# EAGLE schematic PCB Class (EAGLE 8.7.1)
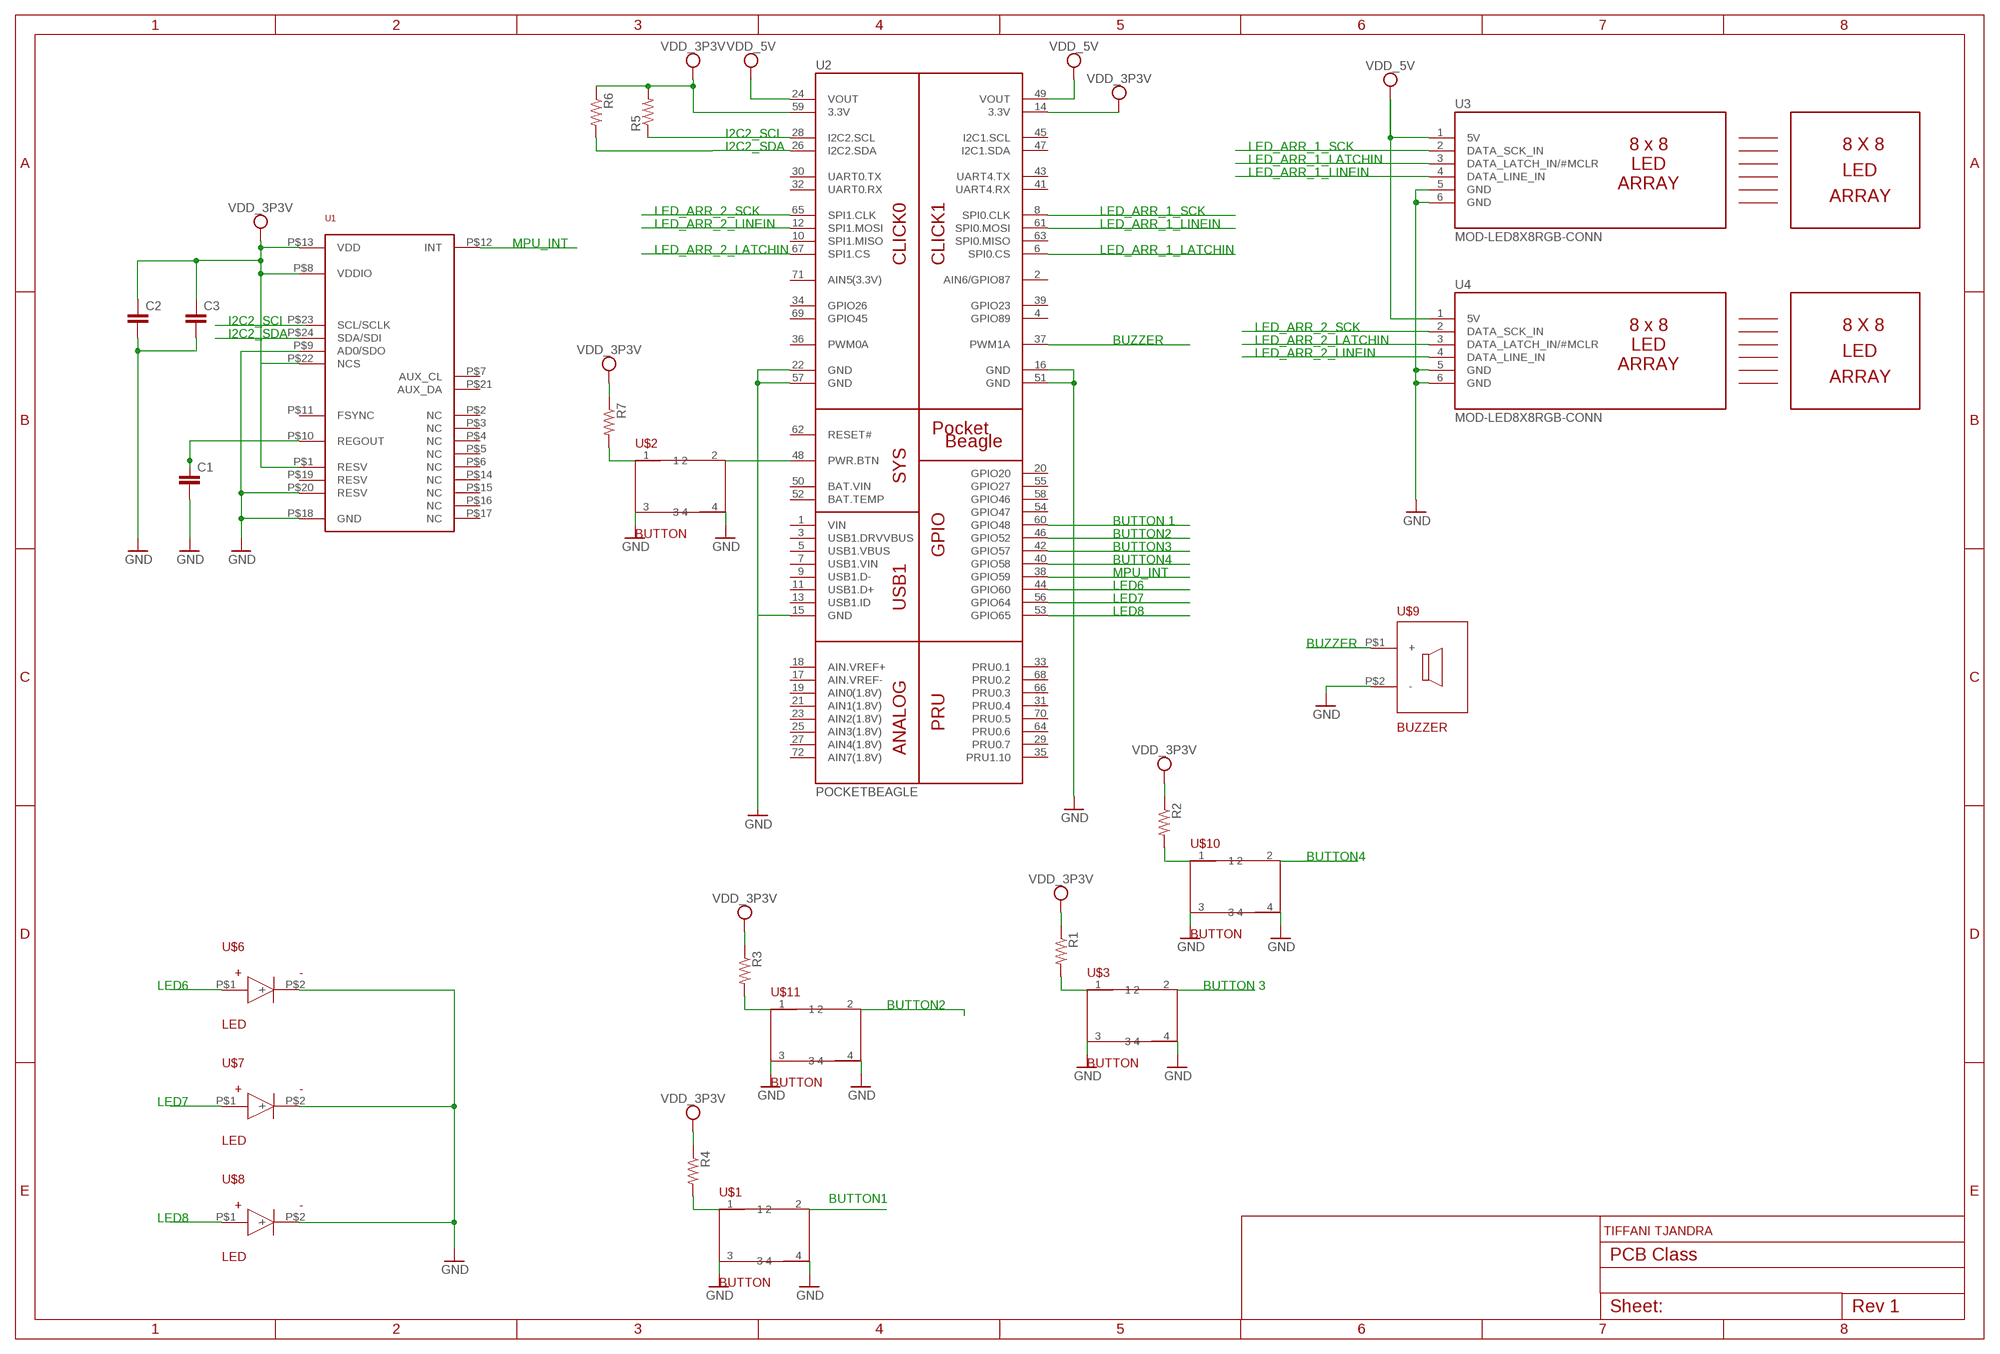
[diagram p0: schematic, sheet 1]

## Parts
C1  C_C0402  [C0402]
C2  C_C0402  [C0402]
C3  C_C0402  [C0402]
R1  R_R6332W  [R6332W]
R2  R_R6332W  [R6332W]
R3  R_R6332W  [R6332W]
R4  R_R6332W  [R6332W]
R5  R_R0402  [R0402]
R6  R_R0402  [R0402]
R7  R_R6332W  [R6332W]
U1  MPU-9250  [PROJECT01]
U2  POCKETBEAGLE  [POCKETBEAGLE]
U3  MOD-LED8X8RGB-CONN  [FE06W]
U4  MOD-LED8X8RGB-CONN  [FE06W]
U$1  BUTTON  [BUTTON]
U$2  BUTTON  [BUTTON]
U$3  BUTTON  [BUTTON]
U$6  LED  [LED]
U$7  LED  [LED]
U$8  LED  [LED]
U$9  BUZZER  [BUZZER]
U$10  BUTTON  [BUTTON]
U$11  BUTTON  [BUTTON]

## Nets
GND: C1.2 C2.2 C3.2 U1.P$9(AD0/SDO) U1.P$18(GND) U1.P$20(RESV) U2.16(GND) U2.51(GND) U3.5(GND) U3.6(GND) U4.5(GND) U4.6(GND) U$1.3 U$1.4 U$2.3 U$2.4 U$3.3 U$3.4 U$6.P$2(-) U$7.P$2(-) U$8.P$2(-) U$9.P$2(-) U$10.3 U$10.4 U$11.3 U$11.4
N$1: R1.2 U$3.1
N$2: R3.2 U$11.1
N$3: R4.2 U$1.1
N$4: R2.2 U$10.1
N$5: U$3.2
N$6: U$9.P$1(+)
N$7: U$6.P$1(+)
N$8: U$7.P$1(+)
N$9: U$8.P$1(+)
N$10: U2.44(GPIO60)
N$11: U2.56(GPIO64)
N$12: U2.37(PWM1A)
N$13: U2.53(GPIO65)
N$14: U$10.2
N$15: U2.40(GPIO58)
N$16: U2.15(GND) U2.22(GND) U2.57(GND)
N$17: U$11.2
N$18: U$1.2
N$19: U2.42(GPIO57)
N$20: U2.46(GPIO52)
N$21: U2.60(GPIO48)
N$22: U3.2(DATA_SCK_IN)
N$23: U3.3(DATA_LATCH_IN/#MCLR)
N$24: U3.4(DATA_LINE_IN)
N$25: U2.8(SPI0.CLK)
N$26: U2.61(SPI0.MOSI)
N$27: U2.6(SPI0.CS)
N$28: U2.65(SPI1.CLK)
N$29: U2.12(SPI1.MOSI)
N$30: U2.67(SPI1.CS)
N$31: U4.2(DATA_SCK_IN)
N$32: U4.3(DATA_LATCH_IN/#MCLR)
N$33: U4.4(DATA_LINE_IN)
N$34: C1.1 U1.P$10(REGOUT)
N$35: R6.2 U2.26(I2C2.SDA)
N$36: U1.P$12(INT)
N$37: U2.38(GPIO59)
N$38: R5.1 U2.28(I2C2.SCL)
N$39: U1.P$23(SCL/SCLK)
N$40: U1.P$24(SDA/SDI)
N$41: R7.2 U$2.1
N$42: U$2.2
SYS_VDD1_3P3V: C2.1 C3.1 R1.1 R2.1 R3.1 R4.1 R5.2 R6.1 R7.1 U1.P$1(RESV) U1.P$8(VDDIO) U1.P$13(VDD) U1.P$22(NCS) U2.14(3.3V) U2.24(VOUT) U2.49(VOUT) U2.59(3.3V) U3.1(5V) U4.1(5V) ; supply symbol labelled VDD_3P3V, VDD_5V
Unconnected: U1.P$2(NC) U1.P$3(NC) U1.P$4(NC) U1.P$5(NC) U1.P$6(NC) U1.P$7(AUX_CL) U1.P$11(FSYNC) U1.P$14(NC) U1.P$15(NC) U1.P$16(NC) U1.P$17(NC) U1.P$19(RESV) U1.P$21(AUX_DA) U2.1(VIN) U2.2(AIN6/GPIO87) U2.3(USB1.DRVVBUS) U2.4(GPIO89) U2.5(USB1.VBUS) U2.7(USB1.VIN) U2.9(USB1.D-) U2.10(SPI1.MISO) U2.11(USB1.D+) U2.13(USB1.ID) U2.17(AIN.VREF-) U2.18(AIN.VREF+) U2.19(AIN0(1.8V)) U2.20(GPIO20) U2.21(AIN1(1.8V)) U2.23(AIN2(1.8V)) U2.25(AIN3(1.8V)) U2.27(AIN4(1.8V)) U2.29(PRU0.7) U2.30(UART0.TX) U2.31(PRU0.4) U2.32(UART0.RX) U2.33(PRU0.1) U2.34(GPIO26) U2.35(PRU1.10) U2.36(PWM0A) U2.39(GPIO23) U2.41(UART4.RX) U2.43(UART4.TX) U2.45(I2C1.SCL) U2.47(I2C1.SDA) U2.48(PWR.BTN) U2.50(BAT.VIN) U2.52(BAT.TEMP) U2.54(GPIO47) U2.55(GPIO27) U2.58(GPIO46) U2.62(RESET#) U2.63(SPI0.MISO) U2.64(PRU0.6) U2.66(PRU0.3) U2.68(PRU0.2) U2.69(GPIO45) U2.70(PRU0.5) U2.71(AIN5(3.3V)) U2.72(AIN7(1.8V))

## Notes on the sheet
- I2C2_SCI
- I2C2_SDA | LED_ARR_1_SCK | 8 X 8
- LED_ARR_1_LATCHIN
- LED_ARR_1_LINEIN | LED
- ARRAY
- LED_ARR_2_SCK | LED_ARR_1_SCK
- LED_ARR_2_LINEIN | LED_ARR_1_LINEIN
- MPU_INT
- LED_ARR_2_LATCHIN | LED_ARR_1_LATCHIN
- I2C2_SCI
- LED_ARR_2_SCK | 8 X 8
- I2C2_SDA
- BUZZER | LED_ARR_2_LATCHIN
- LED_ARR_2_LINEIN | LED
- ARRAY
- BUTTON 1
- BUTTON2
- BUTTON3
- BUTTON4
- MPU_INT
- LED6
- LED7
- LED8
- BUZZER
- BUTTON4
- LED6 | BUTTON 3
- BUTTON2
- LED7
- BUTTON1
- LED8
- TIFFANI TJANDRA

## Library data of the parts
C1-C3 = ENGI301_design_example:C_: Capacitor SMD. Sizes: 0402, 0603 & 0805
R1-R7 = ENGI301_design_example:R_: RESISTOR, American symbol
U1 = ENGI301_PCB_Design_Project:MPU-9250
U2 = ENGI301_Maze_Project_Parts:POCKETBEAGLE
U3 U4 = ENGI301_Maze_Project_Parts:MOD-LED8X8RGB-CONN
U$1-U$3 U$10 U$11 = ENGI301_Project_2a:BUTTON
U$6-U$8 = ENGI301_Project_2a:LED
U$9 = ENGI301_Project_2a:BUZZER